# Altium schematic sheet [03] -  DAQ.SchDoc
size A3; DocumentNumber: 3; SheetNumber: 3; SheetTotal: 10
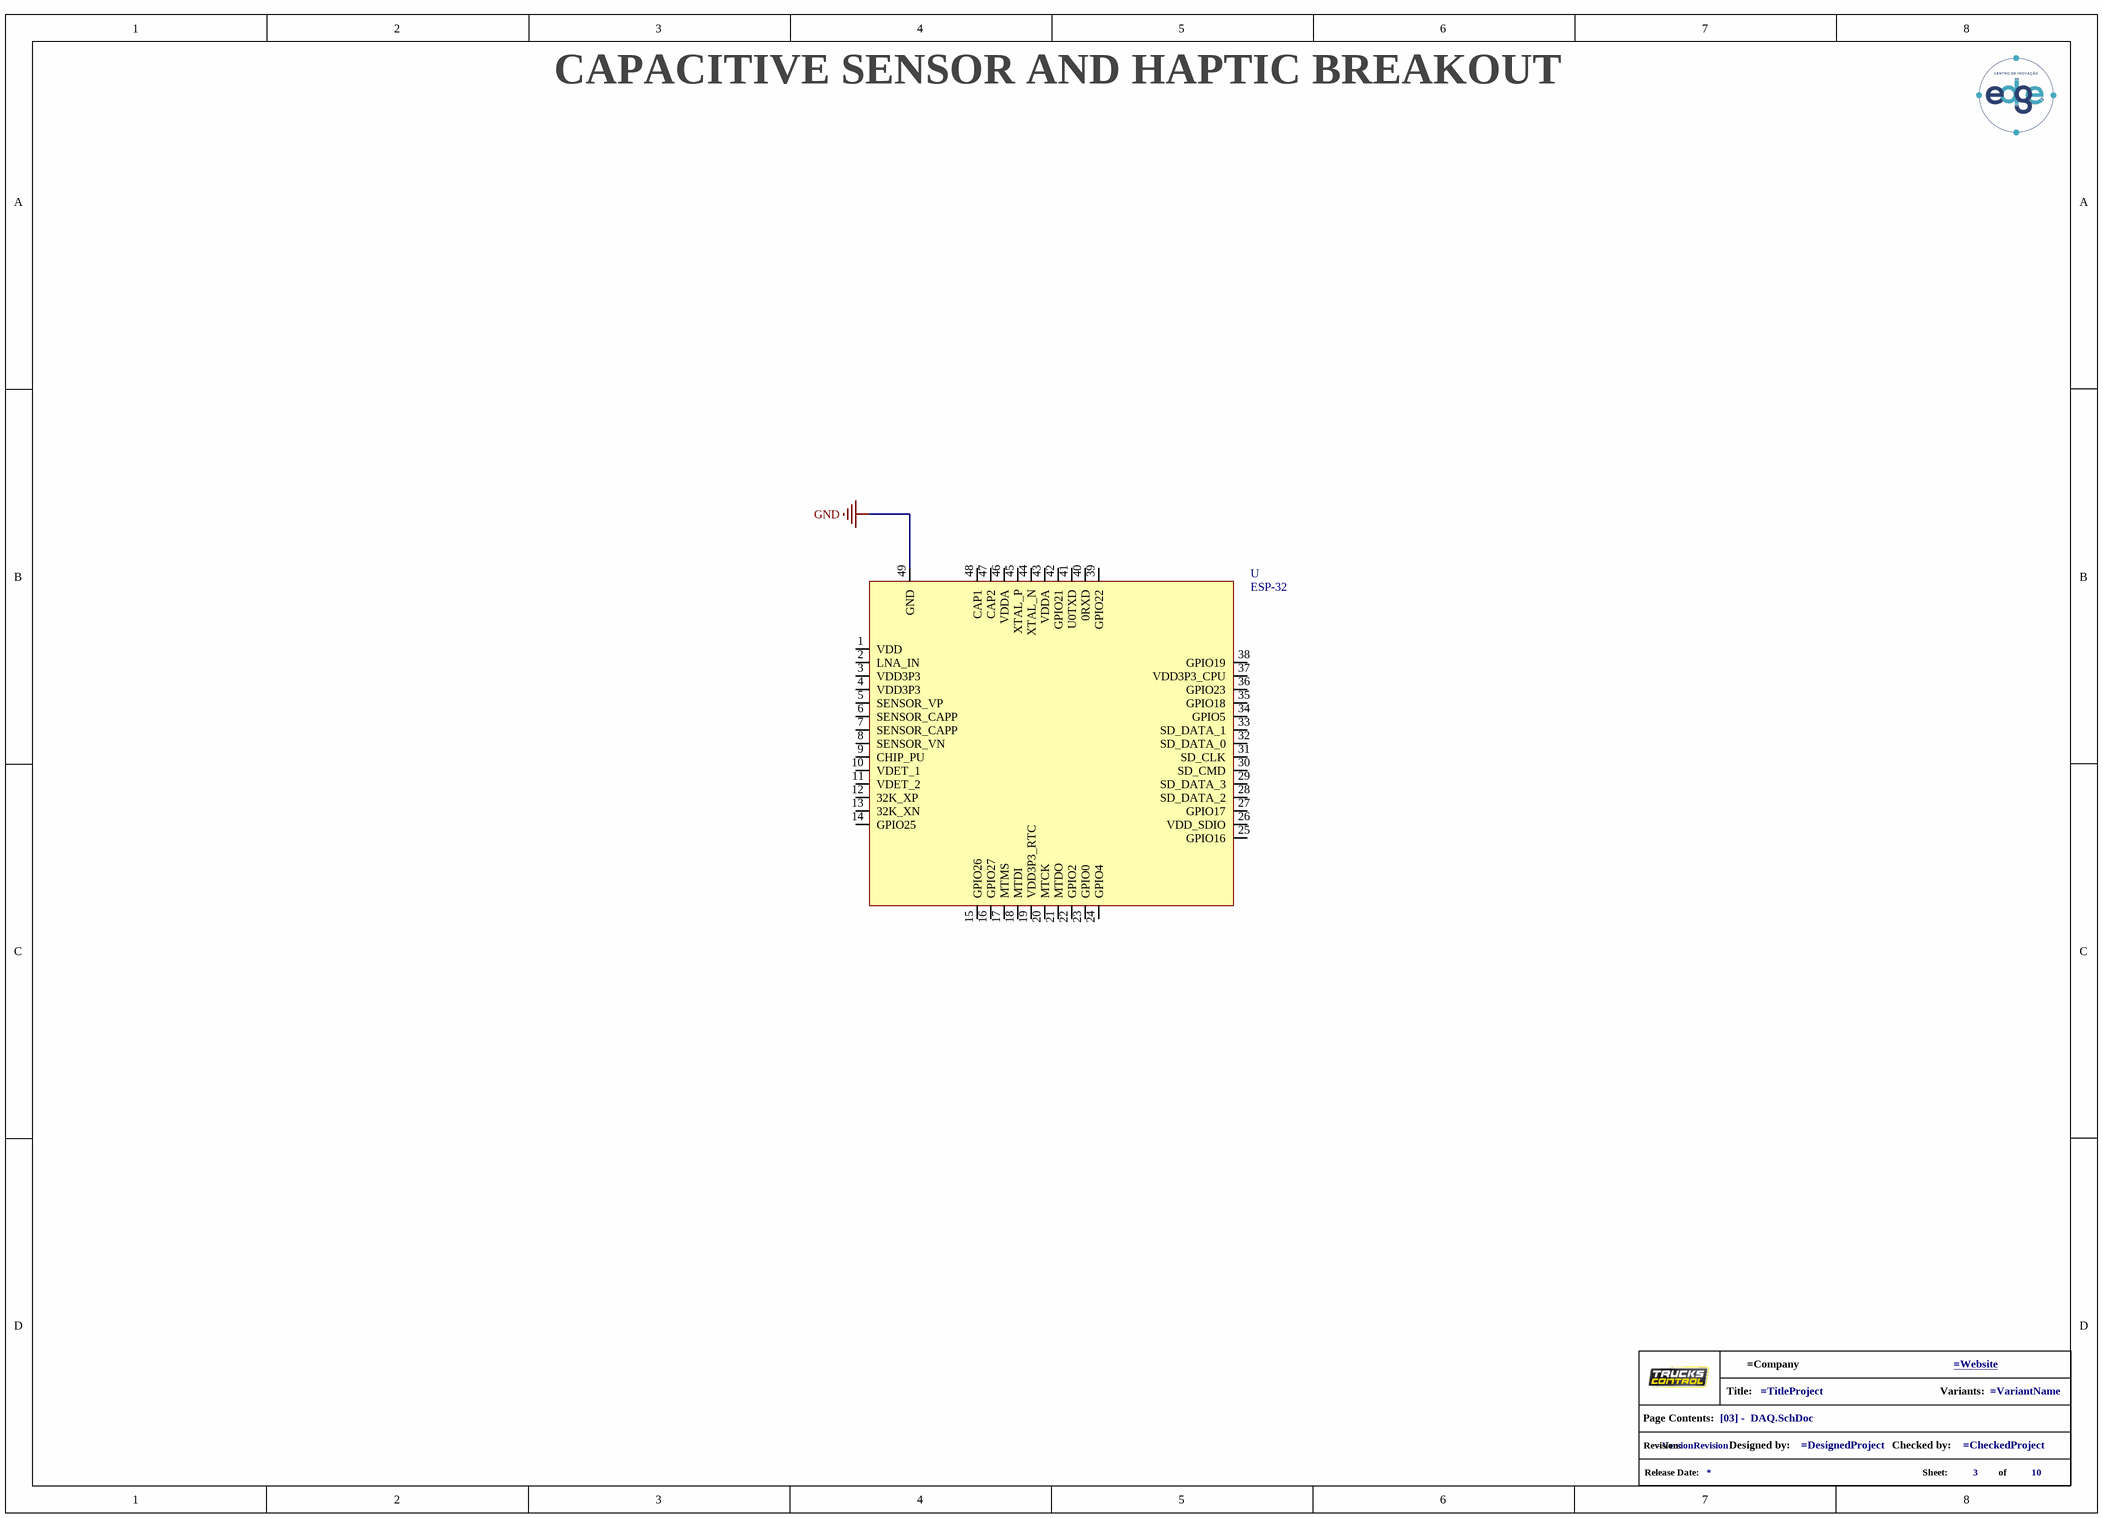
[diagram p0: [03] -  DAQ.SchDoc]

## Parts
GPH?  info_project  (value not drawn)  (graphical)
U  ESP-32  (no BOM)

## Nets
GND: U.49(GND)

Not connected (* = marked no-connect by the designer): U 1(VDD) 2(LNA_IN) 3(VDD3P3) 4(VDD3P3) 5(SENSOR_VP) 6(SENSOR_CAPP) 7(SENSOR_CAPP) 8(SENSOR_VN) 9(CHIP_PU) 10(VDET_1) 11(VDET_2) 12(32K_XP) 13(32K_XN) 14(GPIO25) 15(GPIO26) 16(GPIO27) 17(MTMS) 18(MTDI) 19(VDD3P3_RTC) 20(MTCK) 21(MTDO) 22(GPIO2) 23(GPIO0) 24(GPIO4) 25(GPIO16) 26(VDD_SDIO) 27(GPIO17) 28(SD_DATA_2) 29(SD_DATA_3) 30(SD_CMD) 31(SD_CLK) 32(SD_DATA_0) 33(SD_DATA_1) 34(GPIO5) 35(____GPIO18) 36(GPIO23) 37(VDD3P3_CPU) 38(GPIO19) 39(GPIO22) 40(0RXD) 41(U0TXD) 42(GPIO21) 43(VDDA) 44(XTAL_N) 45(XTAL_P) 46(VDDA) 47(CAP2) 48(CAP1)

## Notes on the sheet
- CAPACITIVE SENSOR AND HAPTIC BREAKOUT
- (in symbol info_project) Title:; Variants:; Page Contents:; Revision:; Designed by:; Checked by:; Release Date:; Sheet:; of

## Library data of the parts
GPH? = info_project: GRAPHICAL - Info Project
U = ESP32: Supplier 1: Digi-Key; Supplier Part Number 1: 1904-1004-1-ND; .SchChecked: *